# EAGLE design FetV1 (EAGLE 6.6.0)
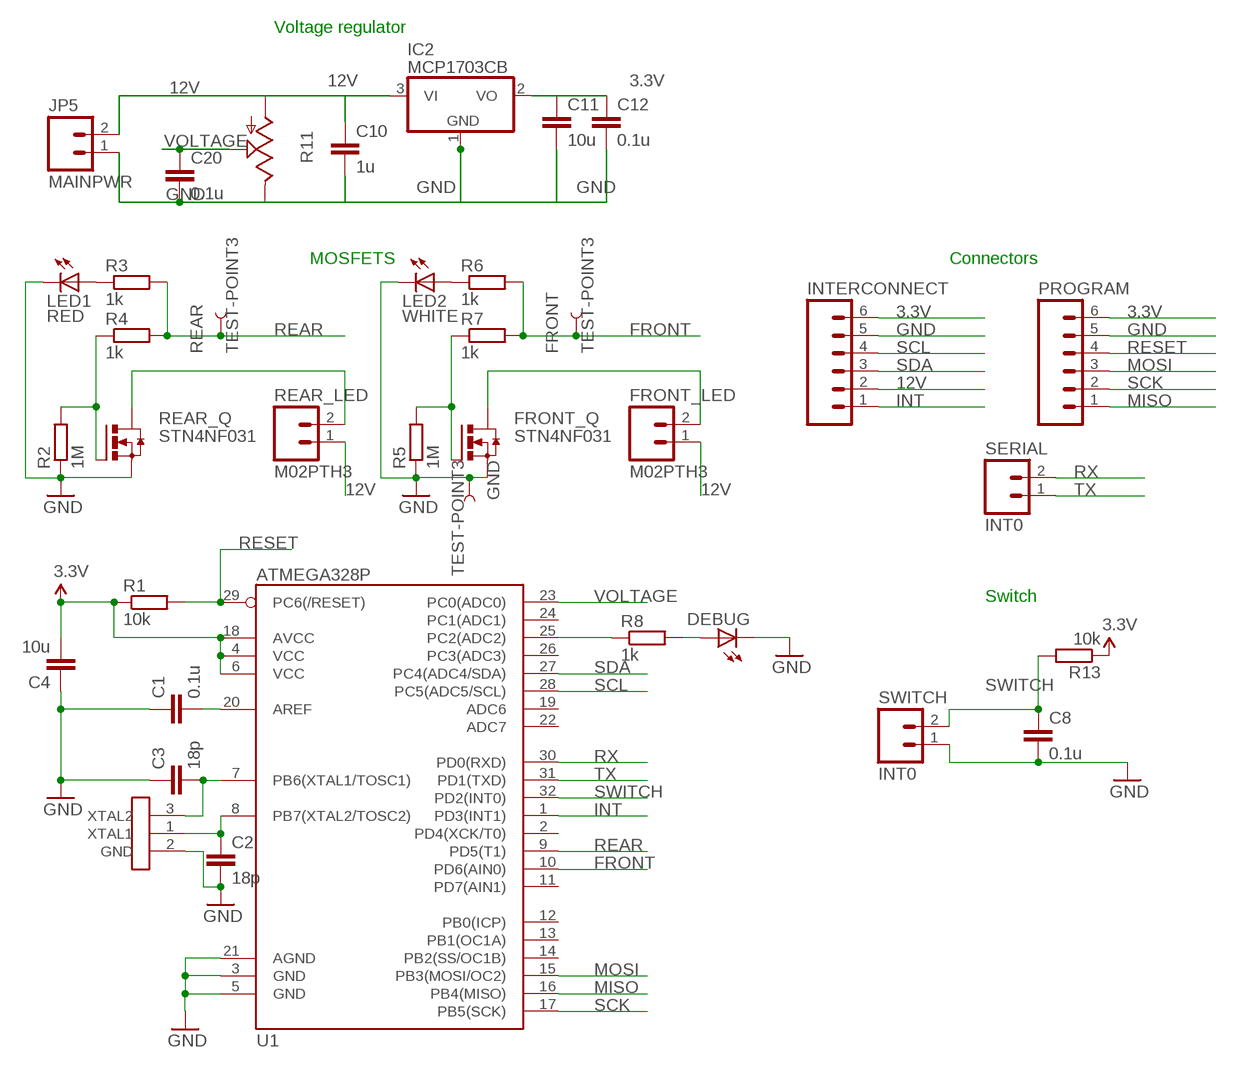
[diagram p0: schematic, sheet 1]

## Parts
C1  0.1u  C-EUC0805  [C0805]
C2  18p  C-EUC0805  [C0805]
C3  18p  C-EUC0805  [C0805]
C4  10u  C-EUC0805  [C0805]
C8  0.1u  C-EUC0805  [C0805]
C10  1u  C-EUC0805  [C0805]
C11  10u  C-EUC0805  [C0805]
C12  0.1u  C-EUC0805  [C0805]
C20  0.1u  C-EUC0805  [C0805]
DEBUG  LEDSML0805  [SML0805]
FRONT  TEST-POINT3  [PAD.03X.03]
FRONT_LED  M02PTH3  [1X02_LONGPADS]
FRONT_Q  STN4NF031  N-HEXFET-2D_SOT232-  [SOT223]
GND  TEST-POINT3  [PAD.03X.03]
IC2  MCP1703CB  [SOT23]
INTERCONNECT  M06SIP  [1X06]
JP5  MAINPWR  M02PTH3  [1X02_LONGPADS]
LED1  RED  LEDSML0805  [SML0805]
LED2  WHITE  LEDSML0805  [SML0805]
PROGRAM  M06SIP  [1X06]
R1  10k  R-EU_R0805  [R0805]
R2  1M  R-EU_R0805  [R0805]
R3  1k  R-EU_R0805  [R0805]
R4  1k  R-EU_R0805  [R0805]
R5  1M  R-EU_R0805  [R0805]
R6  1k  R-EU_R0805  [R0805]
R7  1k  R-EU_R0805  [R0805]
R8  1k  R-EU_R0805  [R0805]
R11  TRIM_US-B64W  [B64W]
R13  10k  R-EU_R0805  [R0805]
REAR  TEST-POINT3  [PAD.03X.03]
REAR_LED  M02PTH3  [1X02_LONGPADS]
REAR_Q  STN4NF031  N-HEXFET-2D_SOT232-  [SOT223]
SERIAL  INT0  M02PTH  [1X02]
SWITCH  INT0  M02PTH3  [1X02_LONGPADS]
U1  ATMEGA328P  ATMEGA328_SMT  [TQFP32-08]
U$1  CRYSTAL-GND  [CRYSTAL-SMD-5X3-LARGE-GND]

## Nets
3.3V: C4.2 C11.1 C12.1 IC2.2(VO) INTERCONNECT.6 PROGRAM.6 R1.1 R13.1 U1.4(VCC) U1.6(VCC) U1.18(AVCC)
12V: C10.1 FRONT_LED.1 IC2.3(VI) INTERCONNECT.2 JP5.2 R11.A REAR_LED.1
FRONT: FRONT.P$1 R6.2 R7.2 U1.10(PD6(AIN0))
GND: C1.1 C2.2 C3.1 C4.1 C8.2 C10.2 C11.2 C12.2 C20.2 DEBUG.C FRONT_Q.3(S) GND.P$1 IC2.1(GND) INTERCONNECT.5 JP5.1 LED1.C LED2.C PROGRAM.5 R2.1 R5.1 R11.E REAR_Q.3(S) SWITCH.1 U1.3(GND) U1.5(GND) U1.21(AGND) U$1.2(GND)
INT: INTERCONNECT.1 U1.1(PD3(INT1))
MISO: PROGRAM.1 U1.16(PB4(MISO))
MOSI: PROGRAM.3 U1.15(PB3(MOSI/OC2))
N$1: C3.2 U1.7(PB6(XTAL1/TOSC1)) U$1.3(XTAL2)
N$2: C2.1 U1.8(PB7(XTAL2/TOSC2)) U$1.1(XTAL1)
N$3: DEBUG.A R8.2
N$4: C1.2 U1.20(AREF)
N$5: REAR_LED.2 REAR_Q.2(D) REAR_Q.4(D)
N$6: R2.2 R4.1 REAR_Q.1(G)
N$7: FRONT_LED.2 FRONT_Q.2(D) FRONT_Q.4(D)
N$8: LED1.A R3.1
N$9: FRONT_Q.1(G) R5.2 R7.1
N$10: LED2.A R6.1
N$11: R8.1 U1.25(PC2(ADC2))
REAR: R3.2 R4.2 REAR.P$1 U1.9(PD5(T1))
RESET: PROGRAM.4 R1.2 U1.29(PC6(/RESET))
RX: SERIAL.2 U1.30(PD0(RXD))
SCK: PROGRAM.2 U1.17(PB5(SCK))
SCL: INTERCONNECT.4 U1.28(PC5(ADC5/SCL))
SDA: INTERCONNECT.3 U1.27(PC4(ADC4/SDA))
SWITCH: C8.1 R13.2 SWITCH.2 U1.32(PD2(INT0))
TX: SERIAL.1 U1.31(PD1(TXD))
VOLTAGE: C20.1 R11.S U1.23(PC0(ADC0))
Unconnected: U1.2(PD4(XCK/T0)) U1.11(PD7(AIN1)) U1.12(PB0(ICP)) U1.13(PB1(OC1A)) U1.14(PB2(SS/OC1B)) U1.19(ADC6) U1.22(ADC7) U1.24(PC1(ADC1)) U1.26(PC3(ADC3))

## Notes on the sheet
- Voltage regulator
- MOSFETS | Connectors
- Switch

## Library data of the parts
C1-C4 C8 C10-C12 C20 = rcl:C-EU: CAPACITOR, European symbol
DEBUG LED1 LED2 = led:LED: LED OSRAM: - CHIPLED LG R971, LG N971, LY N971, LG Q971, LY Q971, LO R971, LY R971 LH N974, LH R974 LS Q976, LO Q976, LY Q976 LO Q996 - Hyper CHIPLED LW Q18S LB Q993, LB Q99A, LB R99A - SideLED LS A670, LO A670, LY A670, LG A670, LP A670 LB A673, LV A673, LT A673, LW A673 LH A674 LY A675 LS A676, LA A676, LO A676, LY A676, LW A676 LS A679, LY A679, LG A679 - Hyper Micro SIDELED® LS Y876, LA Y876, LO Y876, LY Y876 LT Y87S - SmartLED LW L88C, LW L88S LB L89C, LB L89S, LG L890 LS L89K, LO L89K, LY L89K LS L896, LA L896, LO L896, LY L896 - TOPLED LS T670, LO T670, LY T670, LG T670, LP T670 LSG T670, LSP T670, LSY T670, LOP T670, LYG T670 LG T671, LOG T671, LSG T671 LB T673, LV T673, LT T673, LW T673 LH T674 LS T676, LA T676, LO T676, LY T676, LB T676, LH T676, LSB T676, LW T676 LB T67C, LV T67C, LT T67C, LS T67K, LO T67K, LY T67K, LW E67C LS E67B, LA E67B, LO E67B, LY E67B, LB E67C, LV E67C, LT E67C LW T67C LS T679, LY T679, LG T679 LS T770, LO T770, LY T770, LG T770, LP T770 LB T773, LV T773, LT T773, LW T773 LH T774 LS E675, LA E675, LY E675, LS T675 LS T776, LA T776, LO T776, LY T776, LB T776 LHGB T686 LT T68C, LB T68C - Hyper Mini TOPLED® LB M676 - Mini TOPLED Santana® LG M470 LS M47K, LO M47K, LY M47K Source: http://www.osram.convergy.de LUXEON: - LUMILED® LXK2-PW12-R00, LXK2-PW12-S00, LXK2-PW14-U00, LXK2-PW14-V00 LXK2-PM12-R00, LXK2-PM12-S00, LXK2-PM14-U00 LXK2-PE12-Q00, LXK2-PE12-R00, LXK2-PE12-S00, LXK2-PE14-T00, LXK2-PE14-U00 LXK2-PB12-K00, LXK2-PB12-L00, LXK2-PB12-M00, LXK2-PB14-N00, LXK2-PB14-P00, LXK2-PB14-Q00 LXK2-PR12-L00, LXK2-PR12-M00, LXK2-PR14-Q00, LXK2-PR14-R00 LXK2-PD12-Q00, LXK2-PD12-R00, LXK2-PD12-S00 LXK2-PH12-R00, LXK2-PH12-S00 LXK2-PL12-P00, LXK2-PL12-Q00, LXK2-PL12-R00 Source: www.luxeon.com KINGBRIGHT: KA-3528ASYC Source: www.kingbright.com
FRONT GND REAR = SparkFun-Passives:TEST-POINT: Bare copper test points for troubleshooting or ICT
FRONT_LED JP5 REAR_LED SERIAL SWITCH = SparkFun-Connectors:M02: Standard 2-pin 0.1" header. Use with - straight break away headers ( PRT-00116) - right angle break away headers (PRT-00553) - swiss pins (PRT-00743) - machine pins (PRT-00117) - female headers (PRT-00115) Molex polarized connector foot print use with: PRT-08233 with associated crimp pins and housings. 2.54_SCREWTERM for use with PRT-10571. 3.5mm Screw Terminal footprints for PRT-08084 5mm Screw Terminal footprints for use with PRT-08433
FRONT_Q REAR_Q = transistor-power:N-HEXFET-2D_?-*: HEXFET® Power MOSFET 2 Drain connects http://www.irf.com/product-info/datasheets/data/irll014n.pdf
IC2 = linear:MCP1703: 250 mA, 16V, Low Quiescent Current LDO Regulator Source: http://ww1.microchip.com/downloads/en/DeviceDoc/22049b.pdf
INTERCONNECT PROGRAM = SparkFun-Connectors:M06: Header 6 Standard 6-pin 0.1" header. Use with straight break away headers (SKU : PRT-00116), right angle break away headers (PRT-00553), swiss pins (PRT-00743), machine pins (PRT-00117), and female headers (PRT-00115). Molex polarized connector foot print use with SKU : PRT-08094 with associated crimp pins and housings. NOTES ON THE VARIANTS LOCK and LOCK_LONGPADS... This footprint was designed to help hold the alignment of a through-hole component (i.e. 6-pin header) while soldering it into place. You may notice that each hole has been shifted either up or down by 0.005 of an inch from it's more standard position (which is a perfectly straight line). This slight alteration caused the pins (the squares in the middle) to touch the edges of the holes. Because they are alternating, it causes a "brace" to hold the component in place. 0.005 has proven to be the perfect amount of "off-center" position when using our standard breakaway headers. Although looks a little odd when you look at the bare footprint, once you have a header in there, the alteration is very hard to notice. Also,if you push a header all the way into place, it is covered up entirely on the bottom side. This idea of altering the position of holes to aid alignment will be further integrated into the Sparkfun Library for other footprints. It can help hold any component with 3 or more connection pins.
R1-R8 R13 = rcl:R-EU_: RESISTOR, European symbol
R11 = pot:TRIM_US-: POTENTIOMETER
U1 = SparkFun-DigitalIC:ATMEGA328_SMT: 32-Pin Atmega328 part Commonly used on Arduino compatible boards Available in QFP and QFN packages TQFP is IC-09069 QFN is non-stock; PROD_ID: IC-09069
U$1 = SparkFun-FreqCtrl:CRYSTAL-GND

## Board
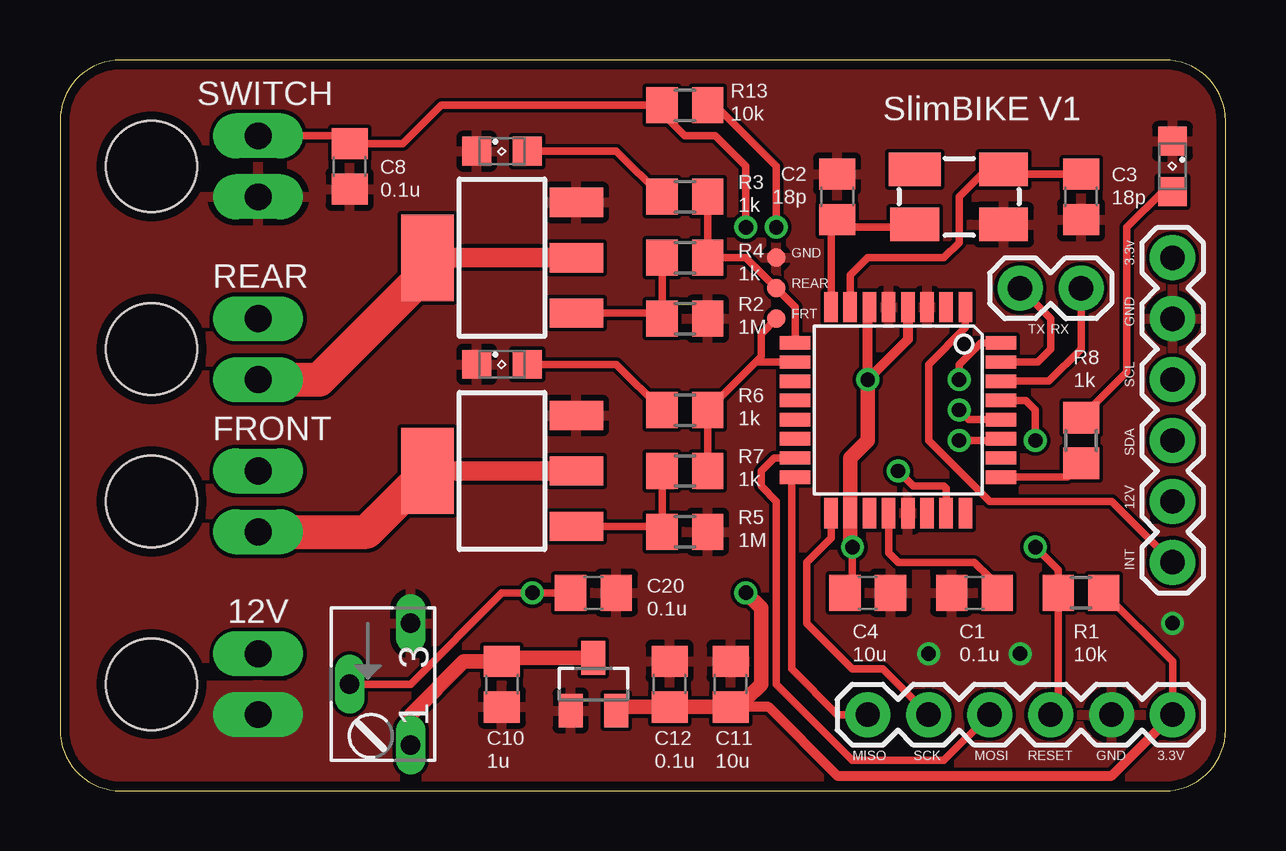
[diagram p1: board, top side]
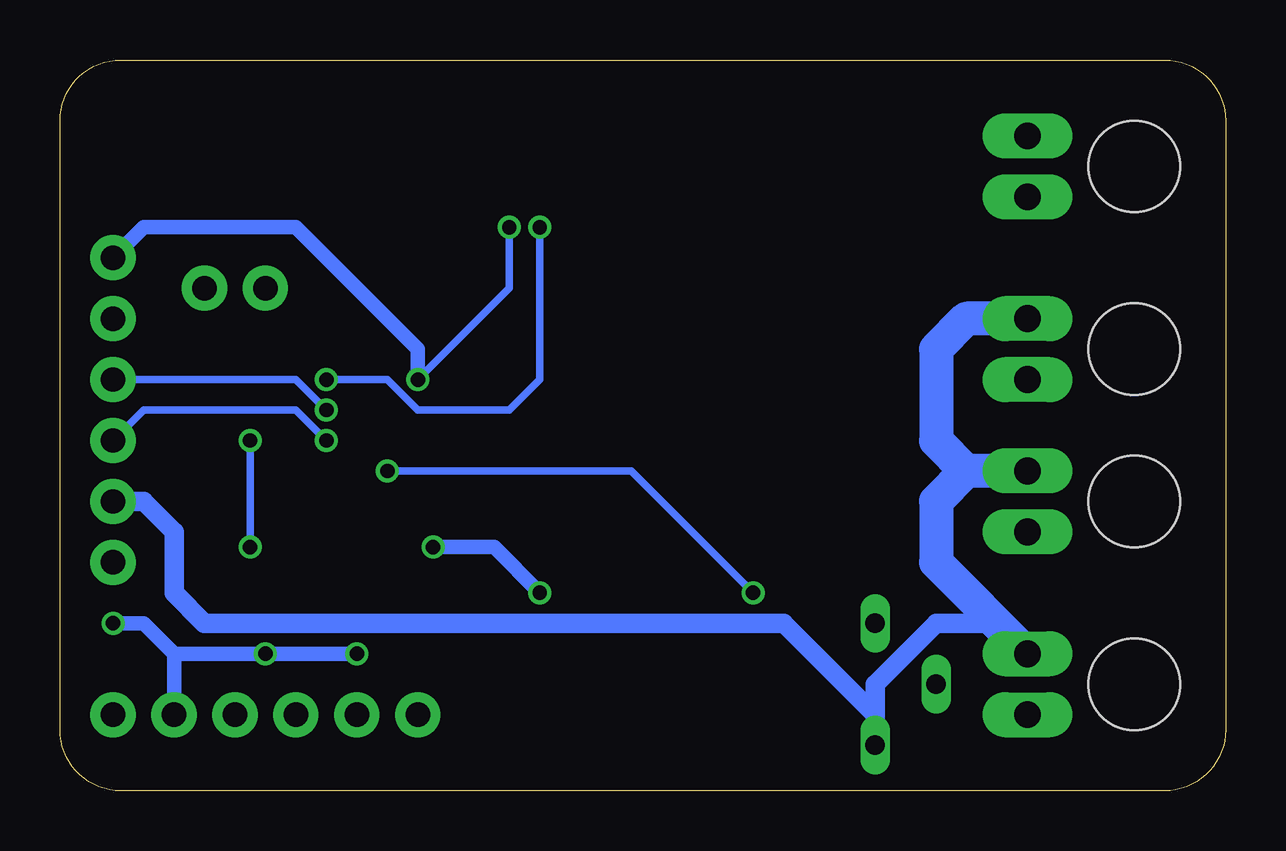
[diagram p2: board, bottom side, seen from below]

Size 48.56 x 30.47 mm. Coordinates in mm from the lower left corner, seen from the top.
Outline: 0,27.93 0,2.54 arc90 2.54,0 46.02,0 arc90 48.56,2.54 48.56,27.93 arc90 46.02,30.47 2.54,30.47 arc90 0,27.93
Copper layers (1*16): Top 0.0356mm / dielectric 1.5011mm / Bottom 0.0356mm
Design rules "LaenPCBOrder": minimum track width 6mil, minimum drill 13mil, track to track 6mil, track to pad 6mil, pad to pad 6mil, via to via 6mil, smd to smd 6mil, copper to edge 15mil, drill to drill 6mil, minimum pad ring 7mil, minimum via ring 7mil, stop-mask expansion 3mil, vias tented up to drill 0mil, thermal gap 10mil
Holes 3.81 mm at 3.81,26.04 3.81,18.41 3.81,12.06 3.81,4.45

### Footprints (pad centres in the part's own frame; a part is rotated, then mirrored left to right if it is on the bottom)
C0805 = smd 1.3 x 1.5: 1 -0.95,0; 2 0.95,0
SML0805 = smd 1.2 x 1.2: A 1.05,0; C -1.05,0
PAD.03X.03 = smd 0.762 x 0.762: P$1 0,0
1X02_LONGPADS = drill 1.118 pad 1.88 long: 1 0,0; 2 2.54,0
SOT223 = smd 1.219 x 2.235: 1 -2.311,-3.099; 2 0,-3.099; 3 2.311,-3.099 | smd 3.6 x 2.2: 4 0,3.099
SOT23 = smd 1 x 1.4: 1 -0.95,-1.1; 2 0.95,-1.1; 3 0,1.1
1X06 = drill 1.016 pad 1.88: 1 0,0; 2 2.54,0; 3 5.08,0; 4 7.62,0; 5 10.16,0; 6 12.7,0
R0805 = smd 1.3 x 1.5: 1 -0.95,0; 2 0.95,0
B64W = drill 0.813 long: A 2.54,0; E -2.54,0; S 0,-2.54
1X02 = drill 1.016 pad 1.88: 1 0,0; 2 2.54,0
TQFP32-08 = smd 1.27 x 0.559: 1 -4.293,2.8; 2 -4.293,2; 3 -4.293,1.2; 4 -4.293,0.4; 5 -4.293,-0.4; 6 -4.293,-1.2; 7 -4.293,-2; 8 -4.293,-2.8; 17 4.293,-2.8; 18 4.293,-2; 19 4.293,-1.2; 20 4.293,-0.4; 21 4.293,0.4; 22 4.293,1.2; 23 4.293,2; 24 4.293,2.8 | smd 0.559 x 1.27: 9 -2.8,-4.293; 10 -2,-4.293; 11 -1.2,-4.293; 12 -0.4,-4.293; 13 0.4,-4.293; 14 1.2,-4.293; 15 2,-4.293; 16 2.8,-4.293; 25 2.8,4.293; 26 2,4.293; 27 1.2,4.293; 28 0.4,4.293; 29 -0.4,4.293; 30 -1.2,4.293; 31 -2,4.293; 32 -2.8,4.293
CRYSTAL-SMD-5X3-LARGE-GND = smd 2.032 x 1.397: 1 -1.85,-1.15; 2 1.85,-1.15; 3 1.85,1.15 | smd 2.159 x 1.397: 4 -1.85,1.15

### Placement (x,y rotation side)
C1  38.1,8.26 0 top
C2  32.38,24.76 90 top
C3  42.55,24.76 90 top
C4  33.66,8.26 180 top
C8  12.07,26.04 270 top
C10  18.41,4.45 270 top
C11  27.94,4.45 90 top
C12  25.4,4.45 90 top
C20  22.22,8.26 0 top
DEBUG  46.35,26.04 270 top
FRONT  29.84,19.68 0 top
FRONT_LED  8.26,13.34 270 top
FRONT_Q  18.41,13.34 90 top
GND  29.84,22.22 0 top
IC2  22.22,4.45 0 top
INTERCONNECT  46.35,9.53 90 top
JP5  8.26,3.17 90 top
LED1  18.41,26.67 0 top
LED2  18.41,17.78 0 top
PROGRAM  33.66,3.17 0 top
R1  42.55,8.26 180 top
R2  26.04,19.68 180 top
R3  26.04,24.76 0 top
R4  26.04,22.22 0 top
R5  26.04,10.79 180 top
R6  26.04,15.88 0 top
R7  26.04,13.34 0 top
R8  42.55,14.61 90 top
R11  14.61,4.45 270 top
R13  26.04,28.57 180 top
REAR  29.84,20.95 0 top
REAR_LED  8.26,19.68 270 top
REAR_Q  18.41,22.22 90 top
SERIAL  40,20.95 0 top
SWITCH  8.26,24.76 90 top
U1  34.92,15.88 270 top
U$1  37.46,24.76 0 top

### Tracks (layer width: path | path; a pad name or v marks a point on that pad's centre or on a via)
3.3V  (via drill 0.6)
  Top 0.305: IC2.2 23.32,3.5 | 46.35,4.12 PROGRAM.6 46.35,5.4 R1.1 | C4.2 33.02,8.57 v33.02,10.16 | 33.66,20.1 U1.6 | C11.1 28.25,3.81 28.57,3.81 | U1.18 33.02,11.49 | R13.1 27.3,28.57 29.84,26.04 v29.84,23.49
  Top 0.406: 33.66,20.1 v33.66,17.14 35.32,18.81 U1.4 | C11.1 29.52,3.5 32.38,0.64 43.81,0.64 PROGRAM.6
  Top 0.61: 23.32,3.5 C12.1 C11.1 | v33.66,17.14 33.66,14.61 32.92,13.88 U1.18 32.92,10.26 v33.02,10.16 | 28.57,3.81 29.21,4.45 29.21,7.62 v28.57,8.26
  Bottom 0.305: v29.84,23.49 29.84,20.95 v33.66,17.14
  Bottom 0.61: v33.02,10.16 30.48,10.16 v28.57,8.26 | INTERCONNECT.6 45.09,23.49 38.73,23.49 33.66,18.41 v33.66,17.14
12V
  Top 0.305: 18.41,5.71 C10.1 18.56,5.54
  Top 0.61: 18.56,5.54 IC2.3 | R11.A 14.61,3.17 16.82,5.4 C10.1
  Bottom 0.61: JP5.2 9.53,6.99
  Bottom 0.813: INTERCONNECT.2 45.09,12.06 43.81,10.79 43.81,8.26 42.55,6.99 18.41,6.99 14.61,3.17 | 9.53,6.99 12.07,6.99 14.61,4.45 14.61,3.17 | 14.61,3.17 R11.A
  Bottom 1.422: REAR_LED.1 10.79,19.68 12.07,18.41 12.07,14.61 10.79,13.34 | FRONT_LED.1 10.79,13.34 | 10.79,13.34 12.07,12.06 12.07,9.53 JP5.2
FRONT
  Top 0.305: U1.10 28.98,17.88 | 28.98,17.88 28.73,17.62 R6.2 R7.2 | FRONT.P$1 29.21,19.05 29.21,18.1 28.98,17.88
GND  (via drill 0.6)
  Bottom 0.61: v46.35,6.99 45.09,6.99 43.81,5.71 | 43.81,5.71 v40,5.71 v36.2,5.71 | 43.81,5.71 PROGRAM.5
  pour Top: -0.64,31.11 48.64,31.11 arc-90 48.89,29.59 48.89,-0.64 5.33,-0.64 arc-90 -0.64,3.43
  pour Top (no thermals): 5.71,1.91 5.71,4.45 10.79,4.45 10.79,1.91
INT
  Top 0.305: U1.1 37.73,19.31 36.2,17.78 36.2,14.61 38.73,12.06 43.81,12.06 INTERCONNECT.1
MISO
  Top 0.305: PROGRAM.1 32.38,3.17 30.48,5.08 30.48,12.92 U1.16
MOSI
  Top 0.305: U1.15 29.75,13.88 29.21,13.34 29.21,12.7 29.84,12.06 29.84,4.45 33.02,1.27 36.83,1.27 PROGRAM.3
N$1
  Top 0.305: C3.2 39.52,25.71 U$1.3 38.62,25.91 37.46,24.76 37.46,22.86 36.83,22.22 33.66,22.22 32.92,21.49 U1.7
N$2
  Top 0.305: U1.8 32.12,23.23 32.38,23.49 | 32.38,23.49 35.49,23.49 U$1.1 | 32.38,23.49 C2.1
N$3
  Top 0.305: DEBUG.A 45.94,24.98 44.45,23.49 44.45,17.46 R8.2
N$4
  Top 0.305: U1.20 34.52,9.93 34.92,9.53 38.1,9.53 38.73,8.89 38.73,8.58 C1.2
N$5
  Top 0.813: REAR_Q.2 15.88,22.22 REAR_Q.4
  Top 1.422: REAR_LED.2 10.79,17.14 15.88,22.22
N$6
  Top 0.305: R4.1 R2.2 24.86,19.91 REAR_Q.1
N$7
  Top 0.813: FRONT_Q.4 FRONT_Q.2
  Top 1.422: FRONT_LED.2 12.78,10.79 FRONT_Q.4
N$8
  Top 0.305: LED1.A 23.18,26.67 R3.1
N$9
  Top 0.305: R7.1 R5.2 24.86,11.02 FRONT_Q.1
N$10
  Top 0.305: LED2.A 23.18,17.78 R6.1
N$11
  Top 0.305: R8.1 41.96,13.08 U1.25
REAR
  Top 0.305: R3.2 R4.2 28.57,22.22 REAR.P$1 30.63,20.17 U1.9
RESET  (via drill 0.6)
  Top 0.305: PROGRAM.4 41.59,3.5 R1.2 41.59,9.21 v40.64,10.16 | 39.3,16.19 U1.29 40.24,16.27 40.64,15.88 v40.64,14.61
  Bottom 0.305: v40.64,14.61 v40.64,10.16
RX
  Top 0.305: U1.30 41.2,17.07 42.55,18.41 SERIAL.2
SCK
  Top 0.305: U1.17 32.12,10.54 31.12,9.53 31.12,6.99 33.02,5.08 34.29,5.08 PROGRAM.2
SCL  (via drill 0.6)
  Top 0.305: v37.46,15.88 37.87,15.47 U1.28
  Bottom 0.305: v37.46,15.88 38.73,17.14 INTERCONNECT.4
SDA  (via drill 0.6)
  Top 0.305: v37.46,14.61 39.15,14.61 U1.27
  Bottom 0.305: v37.46,14.61 38.73,15.88 45.09,15.88 INTERCONNECT.3
SWITCH  (via drill 0.6)
  Top 0.305: v28.57,23.49 28.57,26.04 27.3,27.3 26.04,27.3 25.08,28.25 R13.2 15.88,28.57 14.29,26.98 C8.1 11.75,27.3 SWITCH.2 | U1.32 38.36,18.67 37.46,17.78 v37.46,17.14
  Bottom 0.305: v37.46,17.14 34.92,17.14 33.66,15.88 29.84,15.88 28.57,17.14 v28.57,23.49
TX
  Top 0.305: U1.31 40.73,17.88 41.27,18.41 41.27,19.68 SERIAL.1
VOLTAGE  (via drill 0.6)
  Top 0.305: v34.92,13.34 35.56,12.7 36.83,12.7 36.92,12.61 U1.23 | C20.1 v19.68,8.26 18.41,8.26 14.61,4.45 R11.S
  Bottom 0.305: v34.92,13.34 24.77,13.34 v19.68,8.26

### Text on the board
_tsilk: SWITCH | SlimBIKE V1 | GND | 3.3v | REAR | REAR | FRT | TX | RX | GND | SCL | FRONT | SDA | 12V | INT | 12V | MISO | SCK | MOSI | RESET | GND | 3.3V